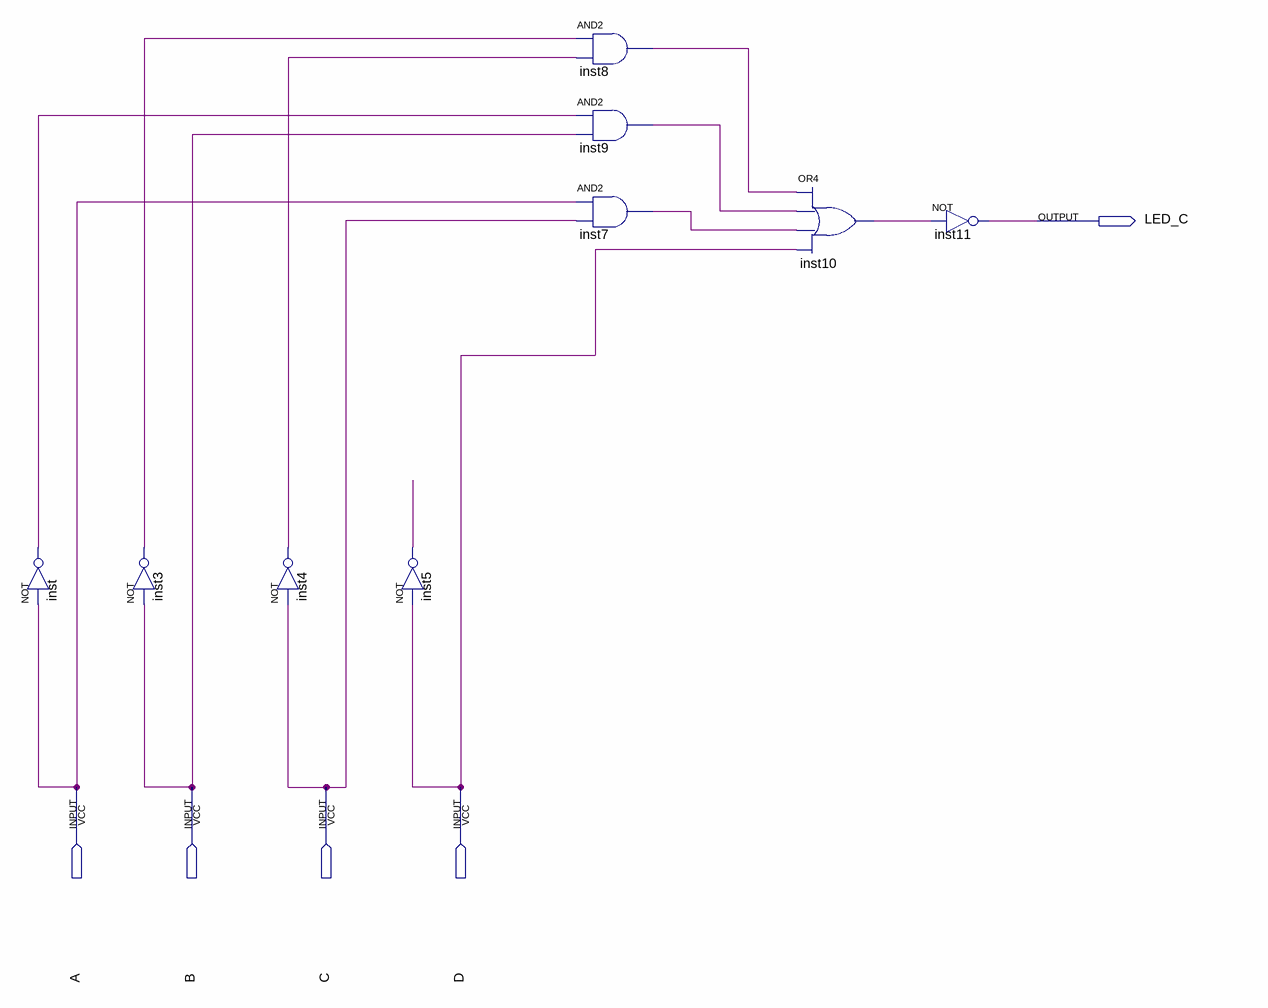
[diagram p0: schematic sheet]
// Quartus schematic led_c.bdf as structural Verilog: 9 symbols, 5 pins
module led_c (
  input  A,
  input  B,
  input  C,
  input  D,
  output LED_C
);

  wire inst3_out, inst4_out, inst5_out, inst7_out, inst8_out, inst9_out, inst10_out, inst_out;

  not inst (inst_out, A);
  not inst3 (inst3_out, B);
  not inst4 (inst4_out, C);
  not inst5 (inst5_out, D);
  and inst8 (inst8_out, inst3_out, inst4_out);
  and inst9 (inst9_out, inst_out, B);
  and inst7 (inst7_out, A, C);
  or inst10 (inst10_out, inst8_out, inst9_out, inst7_out, D);
  not inst11 (LED_C, inst10_out);
endmodule
